# EAGLE schematic interface (EAGLE 6.5.0)
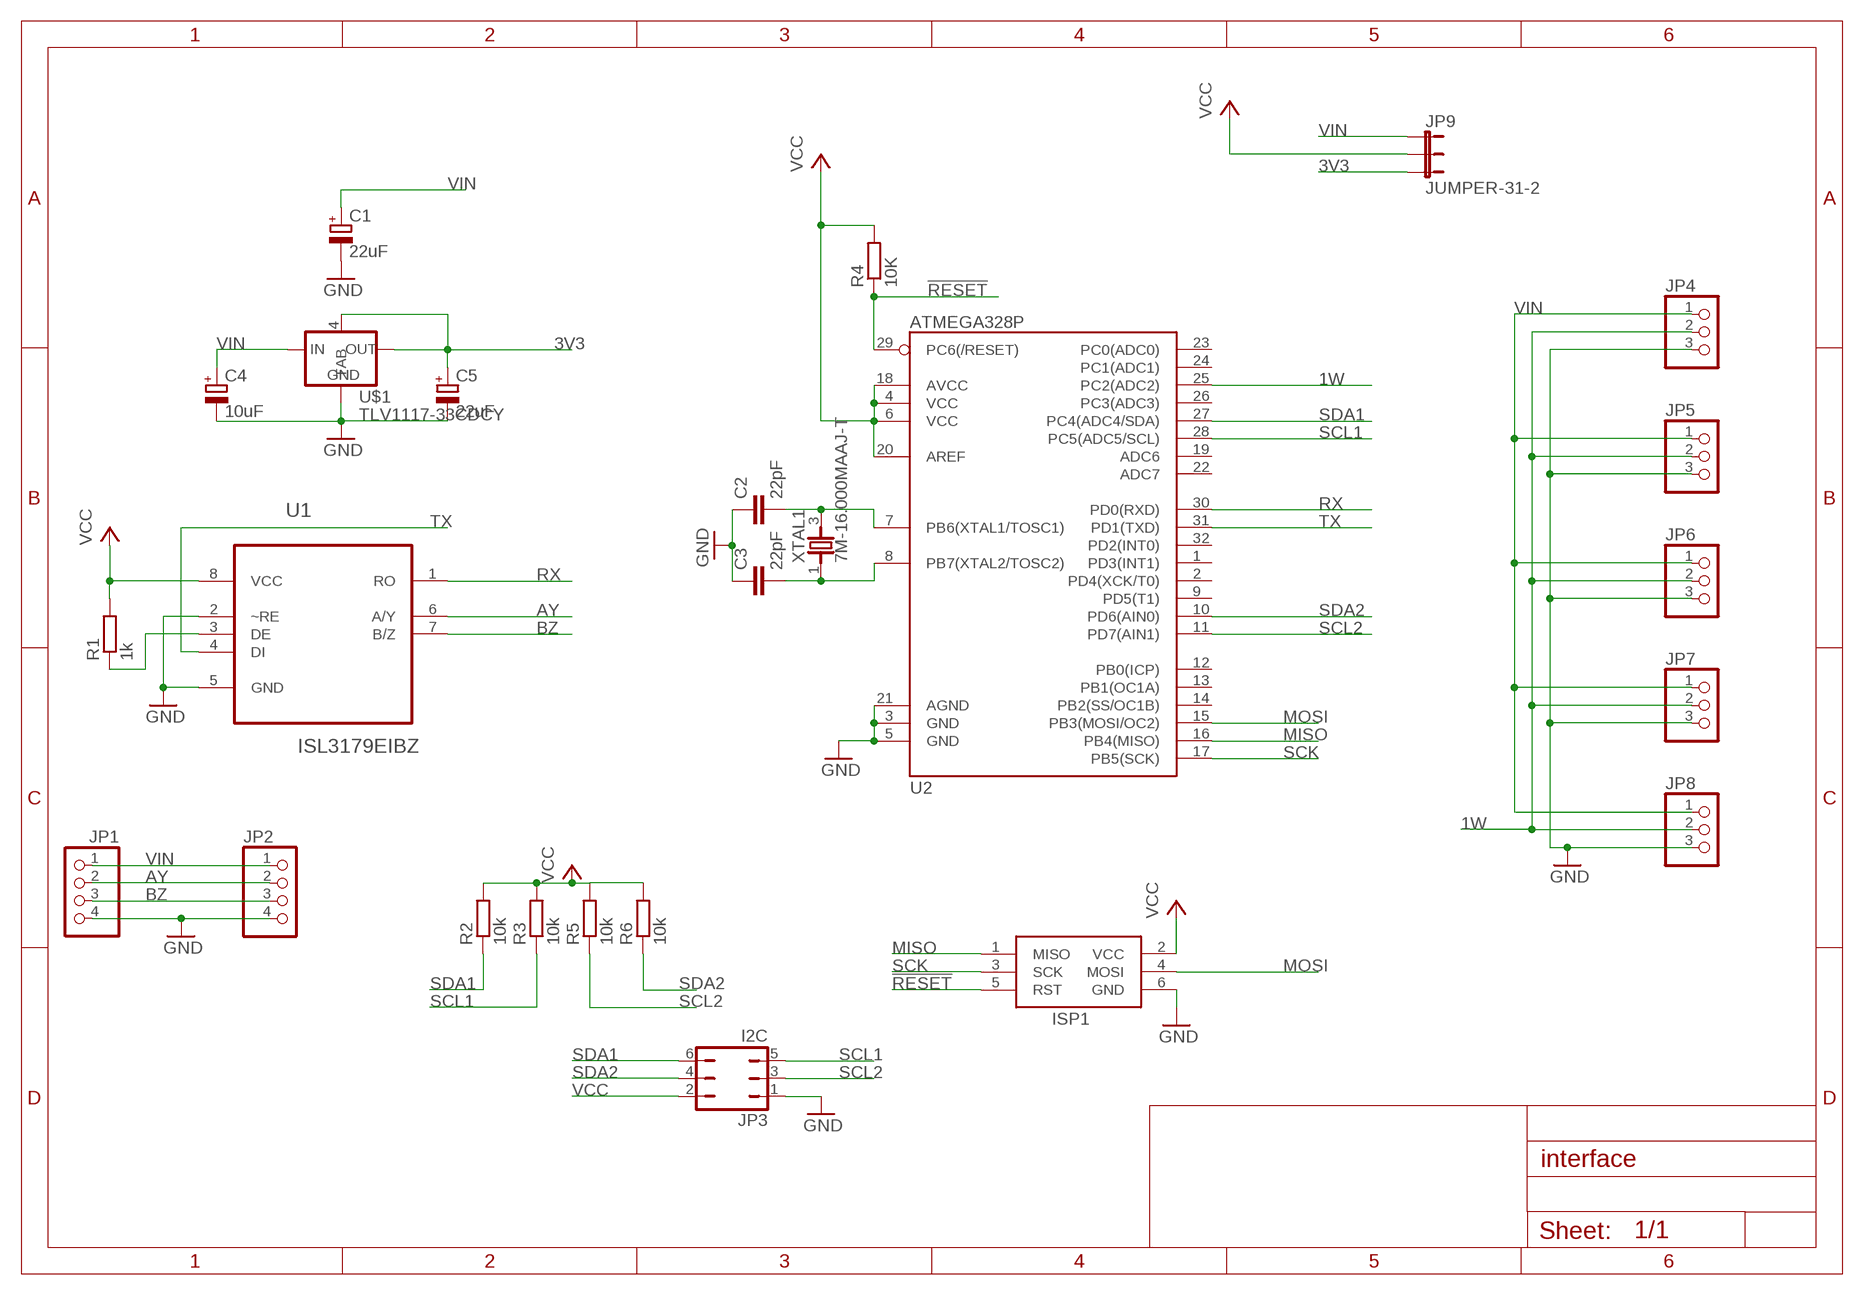
[diagram p0: schematic, sheet 1]

## Parts
C1  22uF  CPOL-EUA/3216-18R  [A/3216-18R]
C2  22pF  C-EUC0805  [C0805]
C3  22pF  C-EUC0805  [C0805]
C4  10uF  CPOL-EUA/3216-18R  [A/3216-18R]
C5  22uF  CPOL-EUA/3216-18R  [A/3216-18R]
ISP1  AVRISP-6  [AVRISP]
JP1  PINHD-1X4  [1X04]
JP2  PINHD-1X4  [1X04]
JP3  I2C  JP3Q  [JP3Q]
JP4  PINHD-1X3  [1X03]
JP5  PINHD-1X3  [1X03]
JP6  PINHD-1X3  [1X03]
JP7  PINHD-1X3  [1X03]
JP8  PINHD-1X3  [1X03]
JP9  JUMPER-31-2  [SJ_3_PASTE1&2]
R1  1k  R-EU_R0805  [R0805]
R2  10k  R-EU_R0805  [R0805]
R3  10k  R-EU_R0805  [R0805]
R4  10K  R-EU_R0805  [R0805]
R5  10k  R-EU_R0805  [R0805]
R6  10k  R-EU_R0805  [R0805]
U1  ISL3179EIBZ  [SOIC127P600X175-8N]
U2  ATMEGA328P  ATMEGA328_SMT  [TQFP32-08]
U$1  TLV1117-33CDCY  [SOT223]
XTAL1  7M-16.000MAAJ-T  [TXC_7M-16.000MAAJ-T]

## Nets
1W: JP4.2 JP5.2 JP6.2 JP7.2 JP8.2 U2.25(PC2(ADC2))
3V3: C5.+ JP9.3 U$1.2(OUT) U$1.4(TAB)
!RESET: ISP1.5(RST) R4.1 U2.29(PC6(/RESET))
AY: JP1.2 JP2.2 U1.6(A/Y)
BZ: JP1.3 JP2.3 U1.7(B/Z)
GND: C1.- C2.1 C3.1 C4.- C5.- ISP1.6(GND) JP1.4 JP2.4 JP3.1 JP4.3 JP5.3 JP6.3 JP7.3 JP8.3 U1.2(~RE) U1.5(GND) U2.3(GND) U2.5(GND) U2.21(AGND) U$1.1(GND)
MISO: ISP1.1(MISO) U2.16(PB4(MISO))
MOSI: ISP1.4(MOSI) U2.15(PB3(MOSI/OC2))
N$1: R1.1 U1.3(DE)
N$2: C2.2 U2.7(PB6(XTAL1/TOSC1)) XTAL1.3
N$3: C3.2 U2.8(PB7(XTAL2/TOSC2)) XTAL1.1
RX: U1.1(RO) U2.30(PD0(RXD))
SCK: ISP1.3(SCK) U2.17(PB5(SCK))
SCL1: JP3.5 R3.1 U2.28(PC5(ADC5/SCL))
SCL2: JP3.3 R5.1 U2.11(PD7(AIN1))
SDA1: JP3.6 R2.1 U2.27(PC4(ADC4/SDA))
SDA2: JP3.4 R6.1 U2.10(PD6(AIN0))
TX: U1.4(DI) U2.31(PD1(TXD))
VCC: ISP1.2(VCC) JP3.2 JP9.2 R1.2 R2.2 R3.2 R4.2 R5.2 R6.2 U1.8(VCC) U2.4(VCC) U2.6(VCC) U2.18(AVCC) U2.20(AREF)
VIN: C1.+ C4.+ JP1.1 JP2.1 JP4.1 JP5.1 JP6.1 JP7.1 JP8.1 JP9.1 U$1.3(IN)
Unconnected: U2.1(PD3(INT1)) U2.2(PD4(XCK/T0)) U2.9(PD5(T1)) U2.12(PB0(ICP)) U2.13(PB1(OC1A)) U2.14(PB2(SS/OC1B)) U2.19(ADC6) U2.22(ADC7) U2.23(PC0(ADC0)) U2.24(PC1(ADC1)) U2.26(PC3(ADC3)) U2.32(PD2(INT0))

## Library data of the parts
C1 C4 C5 = resistor:CPOL-EU: POLARIZED CAPACITOR, European symbol
C2 C3 = resistor:C-EU: CAPACITOR, European symbol
ISP1 = adafruit:AVRISP: AVR ISP HEADER Standard 6 pin header for AVR programming
JP1 JP2 = pinhead:PINHD-1X4: PIN HEADER
JP3 = jumper:JP3Q: JUMPER
JP4-JP8 = pinhead:PINHD-1X3: PIN HEADER
JP9 = SparkFun-Passives:JUMPER-3
R1-R6 = resistor:R-EU_: RESISTOR, European symbol
U1 = glacsweb:ISL3179EIBZ: TRANCEIVER; MPN: ISL3179EIBZ; OC_FARNELL: 1439860; OC_NEWARK: 58M7513; PACKAGE: SOIC-8; SUPPLIER: Intersil
U2 = SparkFun-DigitalIC:ATMEGA328_SMT: 32-Pin Atmega328 part Commonly used on Arduino compatible boards Available in QFP and QFN packages TQFP is IC-09069 QFN is non-stock; PROD_ID: IC-09069
U$1 = basestation:TLV1117-33CDCY: Texas Instruments 3.3v 800mA Voltage Regulator http://uk.farnell.com/texas-instruments/tlv1117-33cdcy/v-reg-ldo-3-3v-0-8a-sot-223-4/dp/1494942 Datasheet: http://focus.ti.com/lit/ds/symlink/tlv1117-33.pdf
XTAL1 = TXC-7M-16.000MAAJ-T:7M-16.000MAAJ-T: CRYSTAL SEAM, 16MHZ, 18PF, SMD; MPN: 7M-16.000MAAJ-T; OC_FARNELL: 1842060; OC_NEWARK: 84R5710; PACKAGE: SMD; SUPPLIER: TXC